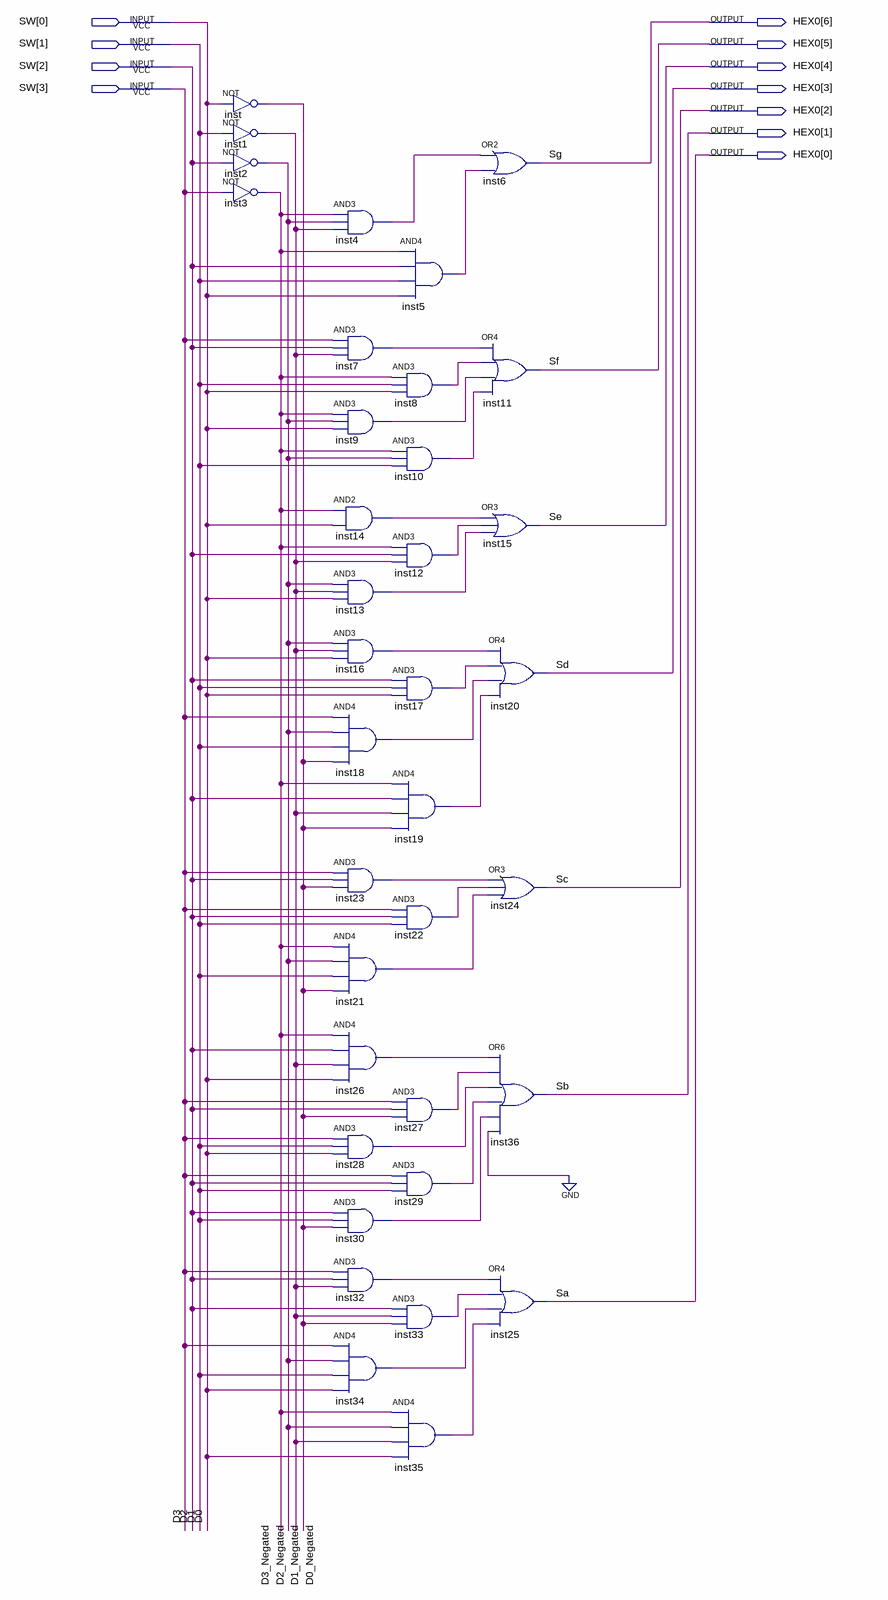
[diagram p0: schematic sheet]
// Quartus schematic lab2_BF.bdf as structural Verilog: 36 symbols, 11 pins
module lab2_BF (
  input  [3:0] SW,
  output [6:0] HEX0
);

  wire D0_Negated, D1_Negated, D2_Negated, D3_Negated, inst4_out, inst5_out, inst7_out, inst8_out, inst9_out,
       inst10_out, inst12_out, inst13_out, inst14_out, inst16_out, inst17_out, inst18_out, inst19_out,
       inst21_out, inst22_out, inst23_out, inst26_out, inst27_out, inst28_out, inst29_out, inst30_out,
       inst32_out, inst33_out, inst34_out, inst35_out;

  not inst (D0_Negated, SW[0]);
  not inst1 (D1_Negated, SW[1]);
  not inst2 (D2_Negated, SW[2]);
  not inst3 (D3_Negated, SW[3]);
  and inst4 (inst4_out, D3_Negated, D2_Negated, D1_Negated);
  and inst7 (inst7_out, SW[3], SW[2], D1_Negated);
  and inst9 (inst9_out, D3_Negated, D2_Negated, SW[0]);
  and inst14 (inst14_out, D3_Negated, SW[0]);
  and inst13 (inst13_out, D2_Negated, D1_Negated, SW[0]);
  and inst16 (inst16_out, D2_Negated, D1_Negated, SW[0]);
  and inst18 (inst18_out, SW[3], D2_Negated, SW[1], D0_Negated);
  and inst23 (inst23_out, SW[3], SW[2], D0_Negated);
  and inst21 (inst21_out, D3_Negated, D2_Negated, SW[1], D0_Negated);
  and inst26 (inst26_out, D3_Negated, SW[2], D1_Negated, SW[0]);
  and inst28 (inst28_out, SW[3], SW[1], SW[0]);
  and inst30 (inst30_out, SW[2], SW[1], D0_Negated);
  and inst32 (inst32_out, SW[3], SW[2], D1_Negated);
  and inst34 (inst34_out, SW[3], D2_Negated, SW[1], SW[0]);
  and inst5 (inst5_out, D3_Negated, SW[2], SW[1], SW[0]);
  and inst8 (inst8_out, D3_Negated, SW[1], SW[0]);
  and inst10 (inst10_out, D3_Negated, D2_Negated, SW[1]);
  and inst12 (inst12_out, D3_Negated, SW[2], D1_Negated);
  and inst17 (inst17_out, SW[2], SW[1], SW[0]);
  and inst19 (inst19_out, D3_Negated, SW[2], D1_Negated, D0_Negated);
  and inst22 (inst22_out, SW[3], SW[2], SW[1]);
  and inst27 (inst27_out, SW[3], SW[2], D0_Negated);
  and inst29 (inst29_out, SW[3], SW[2], SW[1]);
  and inst33 (inst33_out, SW[2], D1_Negated, D0_Negated);
  and inst35 (inst35_out, D3_Negated, D2_Negated, D1_Negated, SW[0]);
  or inst6 (HEX0[6], inst4_out, inst5_out);
  or inst11 (HEX0[5], inst7_out, inst8_out, inst9_out, inst10_out);
  or inst15 (HEX0[4], inst14_out, inst12_out, inst13_out);
  or inst20 (HEX0[3], inst16_out, inst17_out, inst18_out, inst19_out);
  or inst24 (HEX0[2], inst23_out, inst22_out, inst21_out);
  or inst36 (HEX0[1], inst26_out, inst27_out, inst28_out, inst29_out, inst30_out, 1'b0);
  or inst25 (HEX0[0], inst32_out, inst33_out, inst34_out, inst35_out);

  // Other names for the same wires on the sheet: Sa = HEX0[0]; Sb = HEX0[1]; Sc = HEX0[2]; Sd = HEX0[3]; Se = HEX0[4];
  //   Sf = HEX0[5]; Sg = HEX0[6]; D0 = SW[0]; D1 = SW[1]; D2 = SW[2]; D3 = SW[3]
endmodule
